# EAGLE design Tiny_UniProg - Arduino Uno (EAGLE 9.5.1)
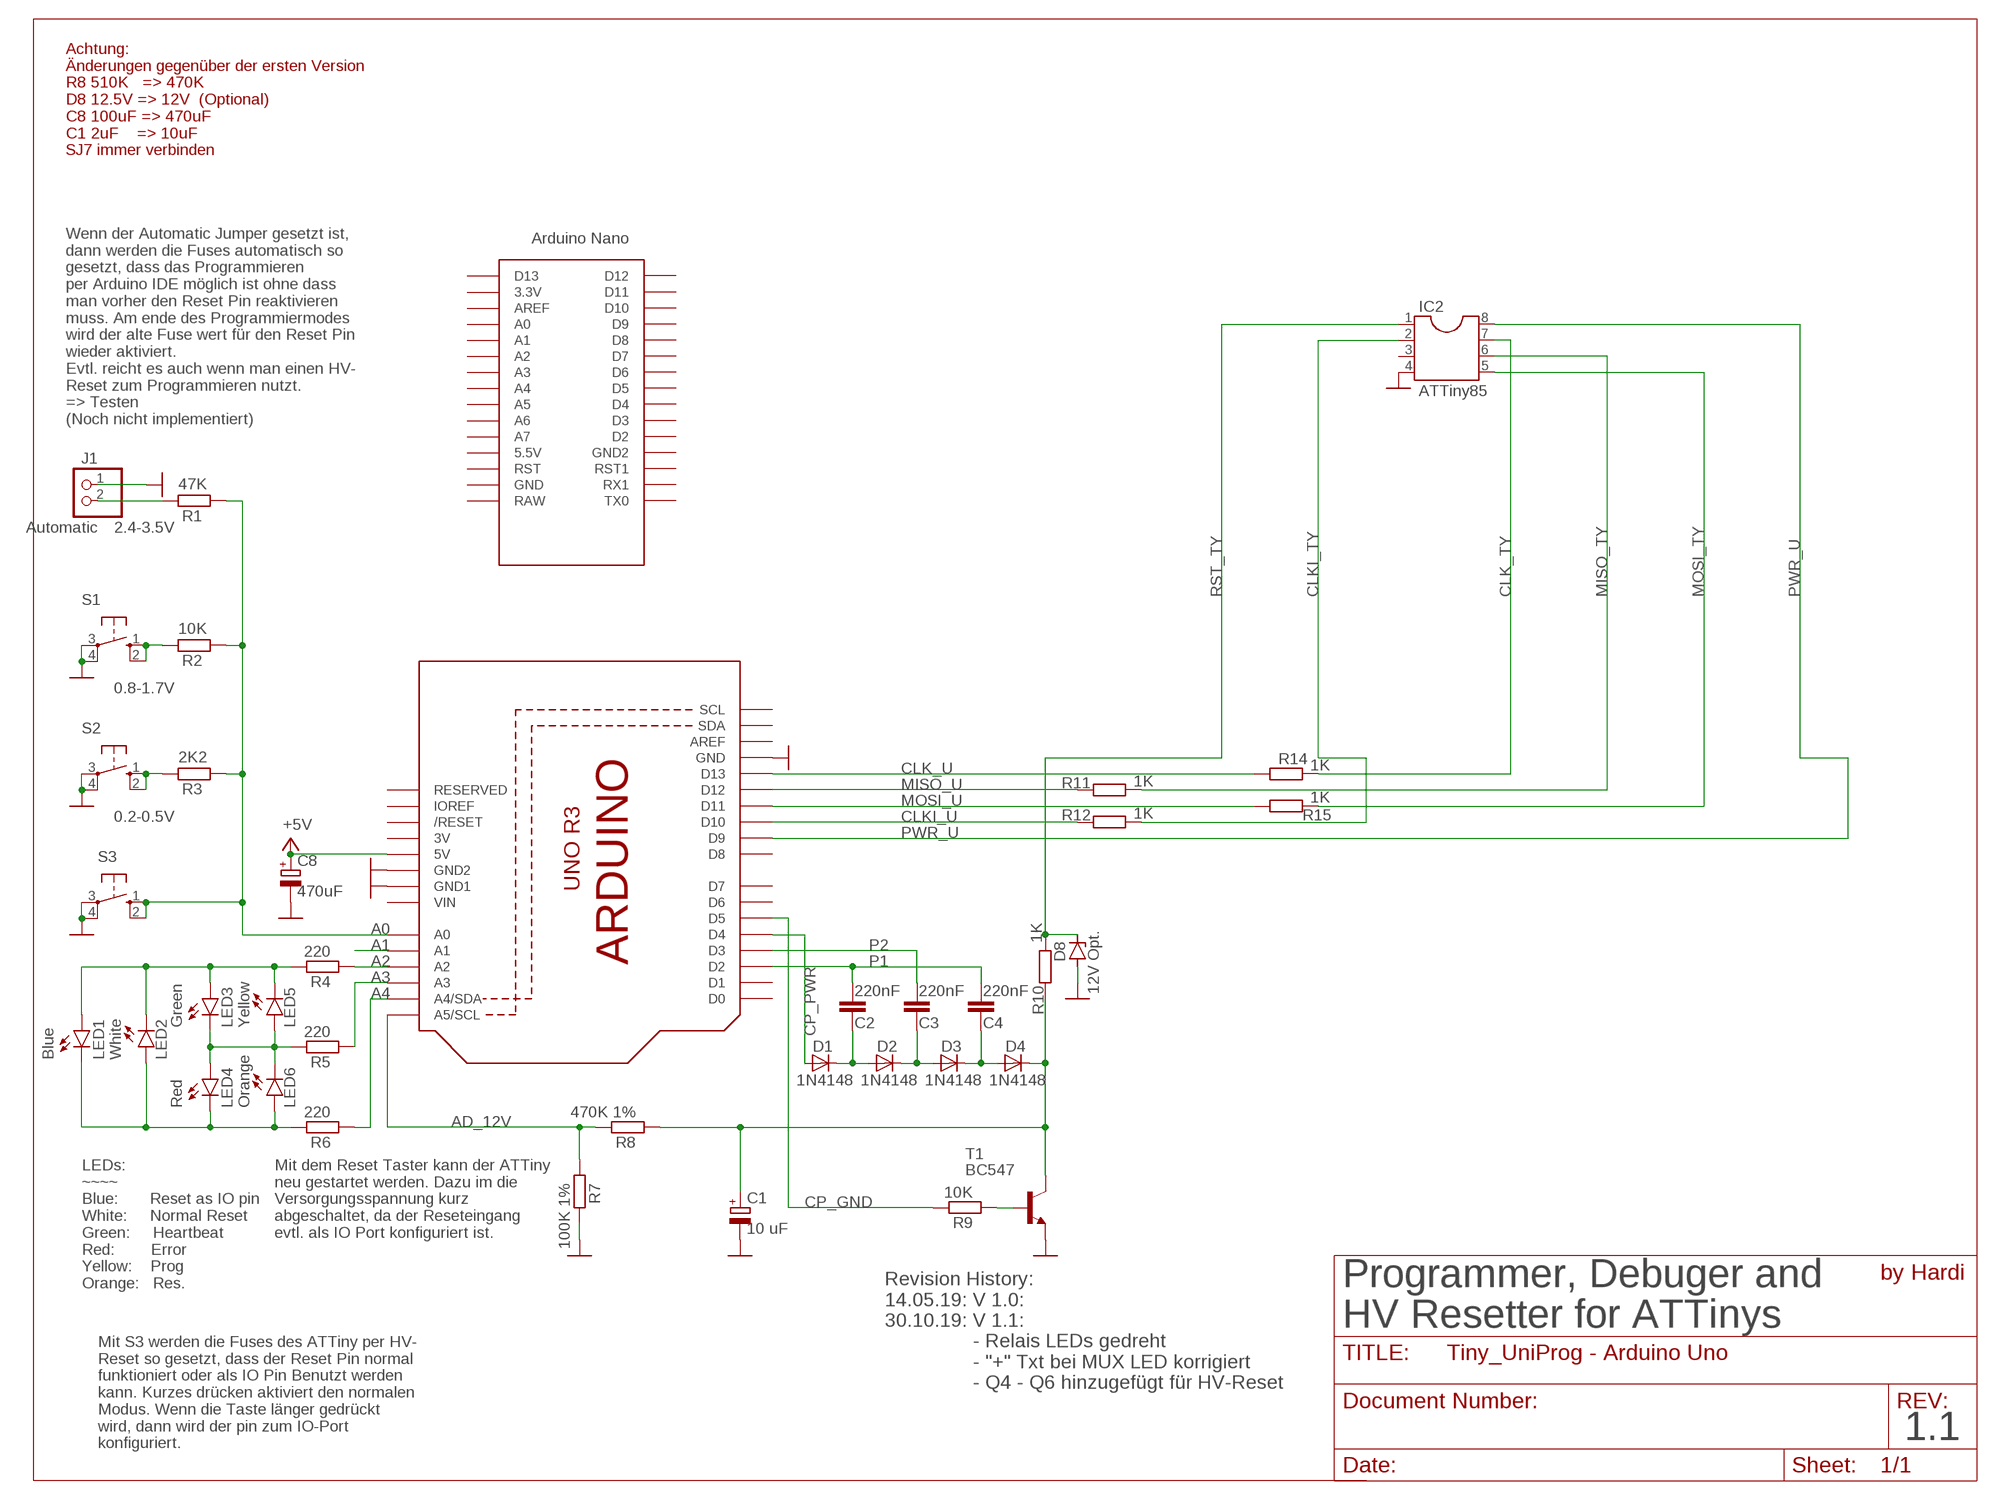
[diagram p0: schematic, sheet 1]

## Parts
C1  10 uF  CPOL-EUE5-5  [E5-5]
C2  220nF  C-EU050-024X044  [C050-024X044]
C3  220nF  C-EU050-024X044  [C050-024X044]
C4  220nF  C-EU050-024X044  [C050-024X044]
C8  470uF  CPOL-EUE5-10.5  [E5-10,5]
D1  1N4148  1N4148DO35-2  [DO35-2]
D2  1N4148  1N4148DO35-2  [DO35-2]
D3  1N4148  1N4148DO35-2  [DO35-2]
D4  1N4148  1N4148DO35-2  [DO35-2]
D8  12V Opt.  ZENER-DIODEZD-2.5  [ZDIO-2.5]
IC2  ATTiny85  DIL8  [DIL08]
J1  Automatic  PINHD-1X2  [1X02]
LED1  Blue  LED3MM  [LED3MM]
LED2  White  LED3MM  [LED3MM]
LED3  Green  LED3MM  [LED3MM]
LED4  Red  LED3MM  [LED3MM]
LED5  Yellow  LED3MM  [LED3MM]
LED6  Orange  LED3MM  [LED3MM]
R1  47K  R-EU_0204/5  [0204/5]
R2  10K  R-EU_0204/2V  [0204V]
R3  2K2  R-EU_0204/2V  [0204V]
R4  220  R-EU_0204/5  [0204/5]
R5  220  R-EU_0204/2V  [0204V]
R6  220  R-EU_0204/5  [0204/5]
R7  100K 1%  R-EU_0204/7  [0204/7]
R8  470K 1%  R-EU_0204/2V  [0204V]
R9  10K  R-EU_0204/7  [0204/7]
R10  1K  R-EU_0207/15  [0207/15]
R11  1K  R-EU_0204/2V  [0204V]
R12  1K  R-EU_0207/7  [0207/7]
R14  1K  R-EU_0204/2V  [0204V]
R15  1K  R-EU_0204/2V  [0204V]
S1  10-XX  [B3F-10XX]
S2  10-XX  [B3F-10XX]
S3  10-XX  [B3F-10XX]
T1  BC547  [TO92]
U1  ARDUINOR3-DIMENSION  [ARDUINOR3]
U$1  NANO  [NANO]

## Nets
+5V: C8.+ U1.5V
A0: R1.1 R2.1 R3.1 S3.1(S) S3.2(S1) U1.A0
A1: U1.A1
A2: R4.1 U1.A2
A3: R5.1 U1.A3
A4: R6.1 U1.A4(A4/SDA)
AD_12V: R7.1 R8.2 U1.A5(A5/SCL)
CLK_TY: IC2.7 R14.2
CLK_U: R14.1 U1.D13
CLKI_TY: IC2.2 R12.2
CLKI_U: R12.1 U1.D10
CP_GND: R9.2 U1.D5
CP_PWR: D1.A U1.D4
GND: C1.- C8.- D8.A IC2.4 J1.1 R7.2 S1.3(P) S1.4(P1) S2.3(P) S2.4(P1) S3.3(P) S3.4(P1) T1.1(E) U1.GND U1.GND1 U1.GND2
MISO_TY: IC2.6 R11.2
MISO_U: R11.1 U1.D12
MOSI_TY: IC2.5 R15.2
MOSI_U: R15.1 U1.D11
N$1: C2.2 D1.C D2.A
N$2: C3.2 D2.C D3.A
N$3: C4.2 D3.C D4.A
N$7: R9.1 T1.2(B)
N$9: C1.+ D4.C R8.1 R10.2 T1.3(C)
N$28: J1.2 R1.2
N$33: R3.2 S2.1(S) S2.2(S1)
N$34: LED1.A LED2.K(C) LED3.A LED5.K(C) R4.2
N$42: LED3.K(C) LED4.A LED5.A LED6.K(C) R5.2
N$44: LED1.K(C) LED2.A LED4.K(C) LED6.A R6.2
N$67: R2.2 S1.1(S) S1.2(S1)
P1: C2.1 C4.1 U1.D2
P2: C3.1 U1.D3
PWR_U: IC2.8 U1.D9
RST_TY: D8.C IC2.1 R10.1
Unconnected: IC2.3 U1.AREF U1.D0 U1.D1 U1.D6 U1.D7 U1.D8 U1.IOREF U1.RESERVED U1.RESET(/RESET) U1.SCL U1.SDA U$1.3.3V U$1.5V(5.5V) U$1.A0 U$1.A1 U$1.A2 U$1.A3 U$1.A4 U$1.A5 U$1.A6 U$1.A7 U$1.AREF U$1.D2 U$1.D3 U$1.D4 U$1.D5 U$1.D6 U$1.D7 U$1.D8 U$1.D9 U$1.D10 U$1.D11 U$1.D12 U$1.D13 U$1.GND U$1.GND1(GND2) U$1.ICSP1 U$1.ICSP2 U$1.ICSP3 U$1.ICSP4 U$1.ICSP5 U$1.ICSP6 U$1.RAW U$1.RST U$1.RST1 U$1.RX1 U$1.TX0

## Notes on the sheet
- Achtung:
  Änderungen gegenüber der ersten Version
  R8 510K   => 470K
  D8 12.5V => 12V  (Optional)
  C8 100uF => 470uF
  C1 2uF    => 10uF
  SJ7 immer verbinden
- Wenn der Automatic Jumper gesetzt ist,
  dann werden die Fuses automatisch so
  gesetzt, dass das Programmieren
  per Arduino IDE möglich ist ohne dass
  man vorher den Reset Pin reaktivieren
  muss. Am ende des Programmiermodes
  wird der alte Fuse wert für den Reset Pin
  wieder aktiviert.
  Evtl. reicht es auch wenn man einen HV-
  Reset zum Programmieren nutzt.
  => Testen
  (Noch nicht implementiert)
- 2.4-3.5V
- 0.8-1.7V
- 0.2-0.5V
- LEDs:
  ~~~~
  Blue:       Reset as IO pin
  White:     Normal Reset
  Green:     Heartbeat
  Red:        Error
  Yellow:    Prog
  Orange:   Res.
- Mit dem Reset Taster kann der ATTiny
  neu gestartet werden. Dazu im die
  Versorgungsspannung kurz
  abgeschaltet, da der Reseteingang
  evtl. als IO Port konfiguriert ist.
- Revision History:
  14.05.19: V 1.0: 
  30.10.19: V 1.1: 
                  - Relais LEDs gedreht 
                  - "+" Txt bei MUX LED korrigiert
                  - Q4 - Q6 hinzugefügt für HV-Reset
- by Hardi
- Programmer, Debuger and 
  HV Resetter for ATTinys
- Mit S3 werden die Fuses des ATTiny per HV-
  Reset so gesetzt, dass der Reset Pin normal
  funktioniert oder als IO Pin Benutzt werden
  kann. Kurzes drücken aktiviert den normalen
  Modus. Wenn die Taste länger gedrückt
  wird, dann wird der pin zum IO-Port 
  konfiguriert.
- 1.1

## Power pins joined to a net without a drawn wire
3V: U1.3V
VIN: U1.VIN

## Library data of the parts
C1 C8 = rcl:CPOL-EU: POLARIZED CAPACITOR, European symbol; SPICEPREFIX: C
C2-C4 = rcl:C-EU: CAPACITOR, European symbol; SPICEPREFIX: C
D1-D4 = diode:1N4148: DIODE high speed (Philips)
D8 = diode:ZENER-DIODE: Z-Diode
IC2 = ic-package:DIL8: Dual In Line / Socket
J1 = pinhead:PINHD-1X2: PIN HEADER
LED1-LED6 = led:LED: LED OSRAM: - CHIPLED LG R971, LG N971, LY N971, LG Q971, LY Q971, LO R971, LY R971 LH N974, LH R974 LS Q976, LO Q976, LY Q976 LO Q996 - Hyper CHIPLED LW Q18S LB Q993, LB Q99A, LB R99A - SideLED LS A670, LO A670, LY A670, LG A670, LP A670 LB A673, LV A673, LT A673, LW A673 LH A674 LY A675 LS A676, LA A676, LO A676, LY A676, LW A676 LS A679, LY A679, LG A679 - Hyper Micro SIDELED® LS Y876, LA Y876, LO Y876, LY Y876 LT Y87S - SmartLED LW L88C, LW L88S LB L89C, LB L89S, LG L890 LS L89K, LO L89K, LY L89K LS L896, LA L896, LO L896, LY L896 - TOPLED LS T670, LO T670, LY T670, LG T670, LP T670 LSG T670, LSP T670, LSY T670, LOP T670, LYG T670 LG T671, LOG T671, LSG T671 LB T673, LV T673, LT T673, LW T673 LH T674 LS T676, LA T676, LO T676, LY T676, LB T676, LH T676, LSB T676, LW T676 LB T67C, LV T67C, LT T67C, LS T67K, LO T67K, LY T67K, LW E67C LS E67B, LA E67B, LO E67B, LY E67B, LB E67C, LV E67C, LT E67C LW T67C LS T679, LY T679, LG T679 LS T770, LO T770, LY T770, LG T770, LP T770 LB T773, LV T773, LT T773, LW T773 LH T774 LS E675, LA E675, LY E675, LS T675 LS T776, LA T776, LO T776, LY T776, LB T776 LHGB T686 LT T68C, LB T68C - Hyper Mini TOPLED® LB M676 - Mini TOPLED Santana® LG M470 LS M47K, LO M47K, LY M47K Source: http://www.osram.convergy.de LUXEON: - LUMILED® LXK2-PW12-R00, LXK2-PW12-S00, LXK2-PW14-U00, LXK2-PW14-V00 LXK2-PM12-R00, LXK2-PM12-S00, LXK2-PM14-U00 LXK2-PE12-Q00, LXK2-PE12-R00, LXK2-PE12-S00, LXK2-PE14-T00, LXK2-PE14-U00 LXK2-PB12-K00, LXK2-PB12-L00, LXK2-PB12-M00, LXK2-PB14-N00, LXK2-PB14-P00, LXK2-PB14-Q00 LXK2-PR12-L00, LXK2-PR12-M00, LXK2-PR14-Q00, LXK2-PR14-R00 LXK2-PD12-Q00, LXK2-PD12-R00, LXK2-PD12-S00 LXK2-PH12-R00, LXK2-PH12-S00 LXK2-PL12-P00, LXK2-PL12-Q00, LXK2-PL12-R00 Source: www.luxeon.com KINGBRIGHT: KA-3528ASYC Source: www.kingbright.com
R1-R12 R14 R15 = rcl:R-EU_: RESISTOR, European symbol; SPICEPREFIX: R
S1-S3 = switch-omron:10-XX: OMRON SWITCH; MPN: B3F-1000; OC_FARNELL: 176432; OC_NEWARK: 36M3542
T1 = transistor:BC547: NPN TRANSISTOR
U1 = adafruit:ARDUINOR3: This is a new object for the new Arduino R3 - with extra pins that you may want to use (such as IOref, and duplicated A4/A5
U$1 = Arduino-clone:NANO: Arduino Nano

## Board
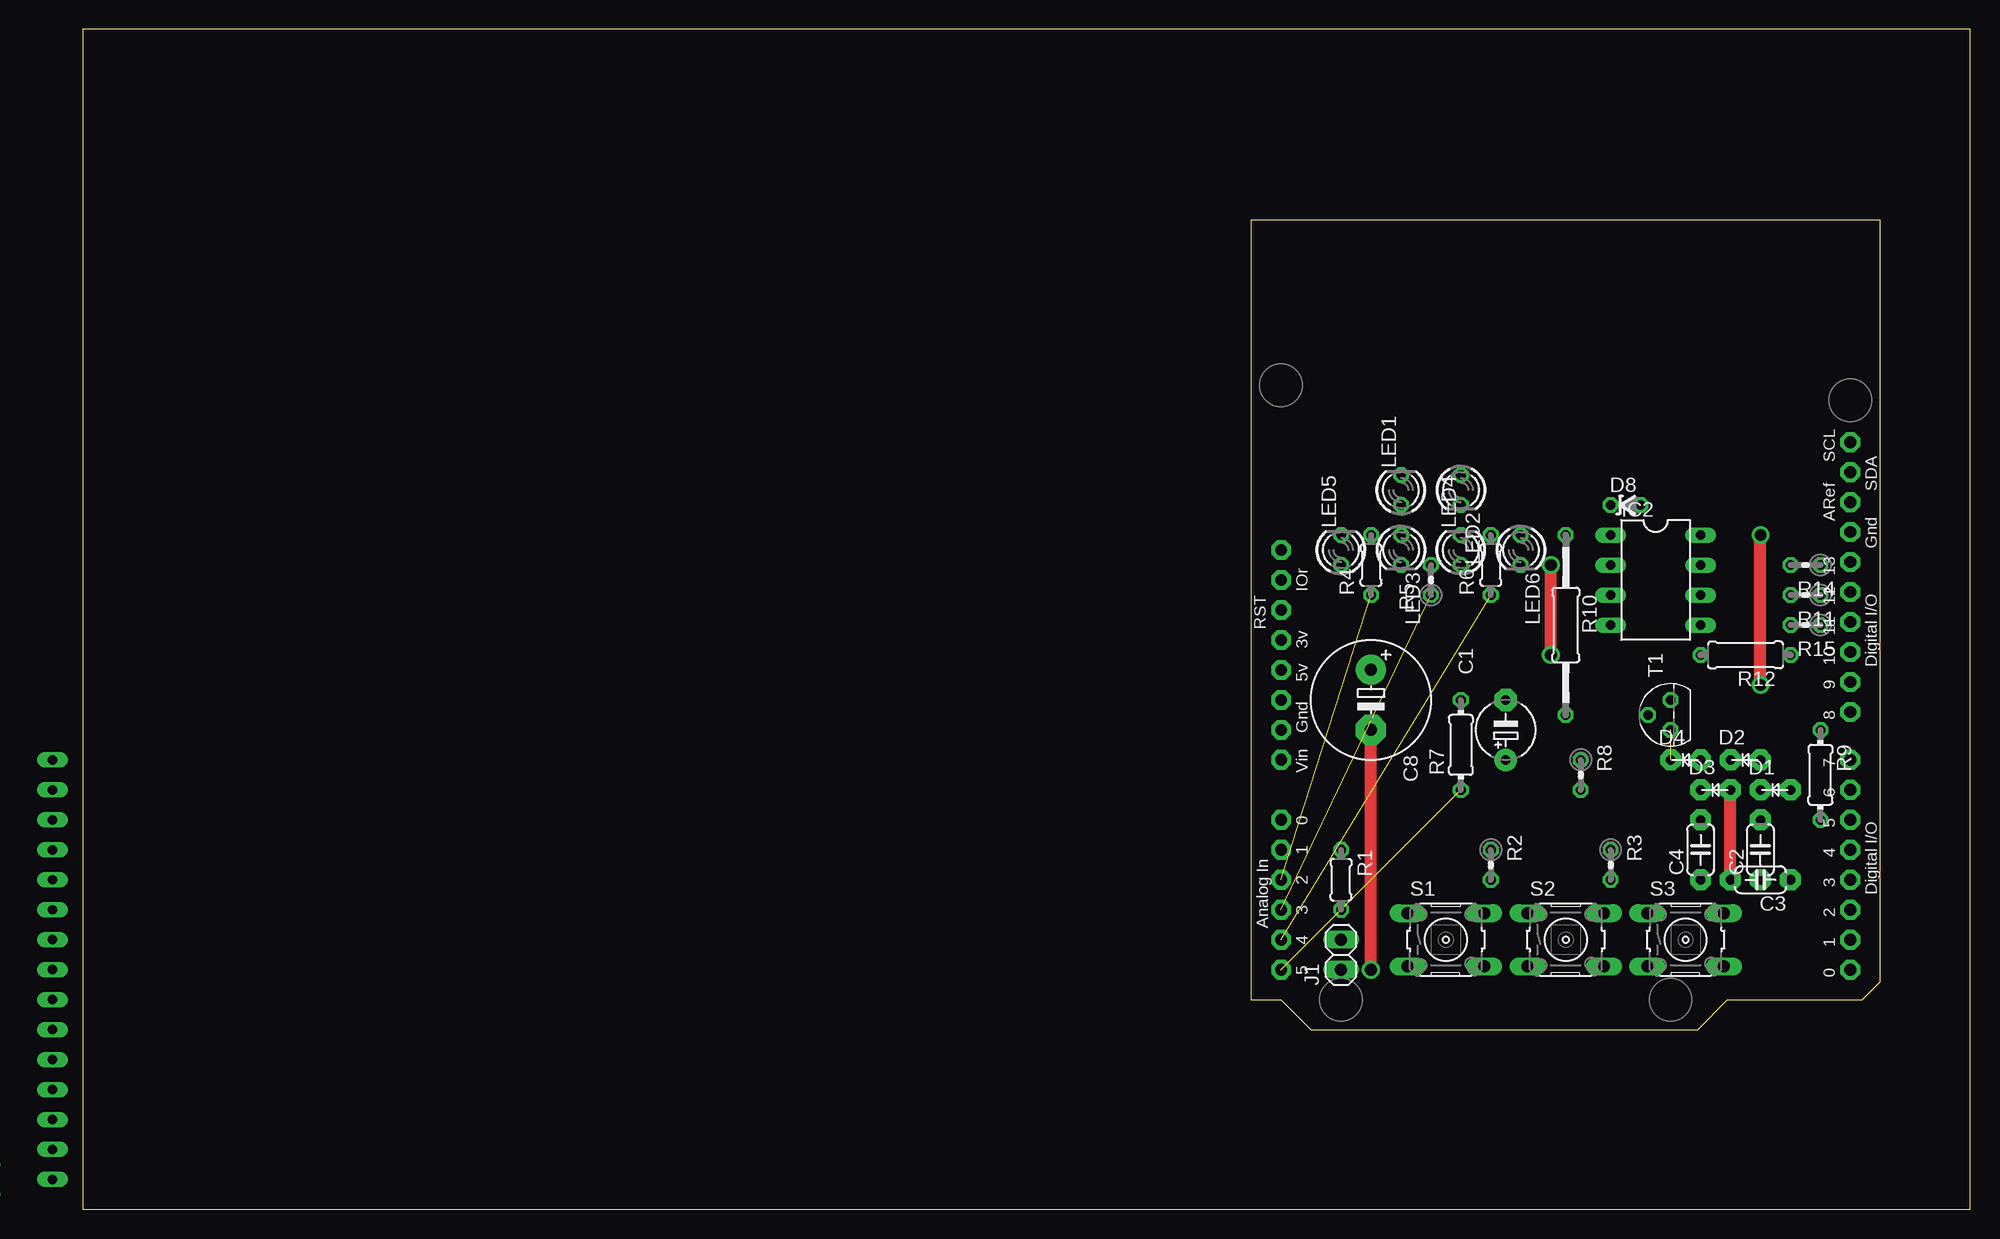
[diagram p1: board, top side]
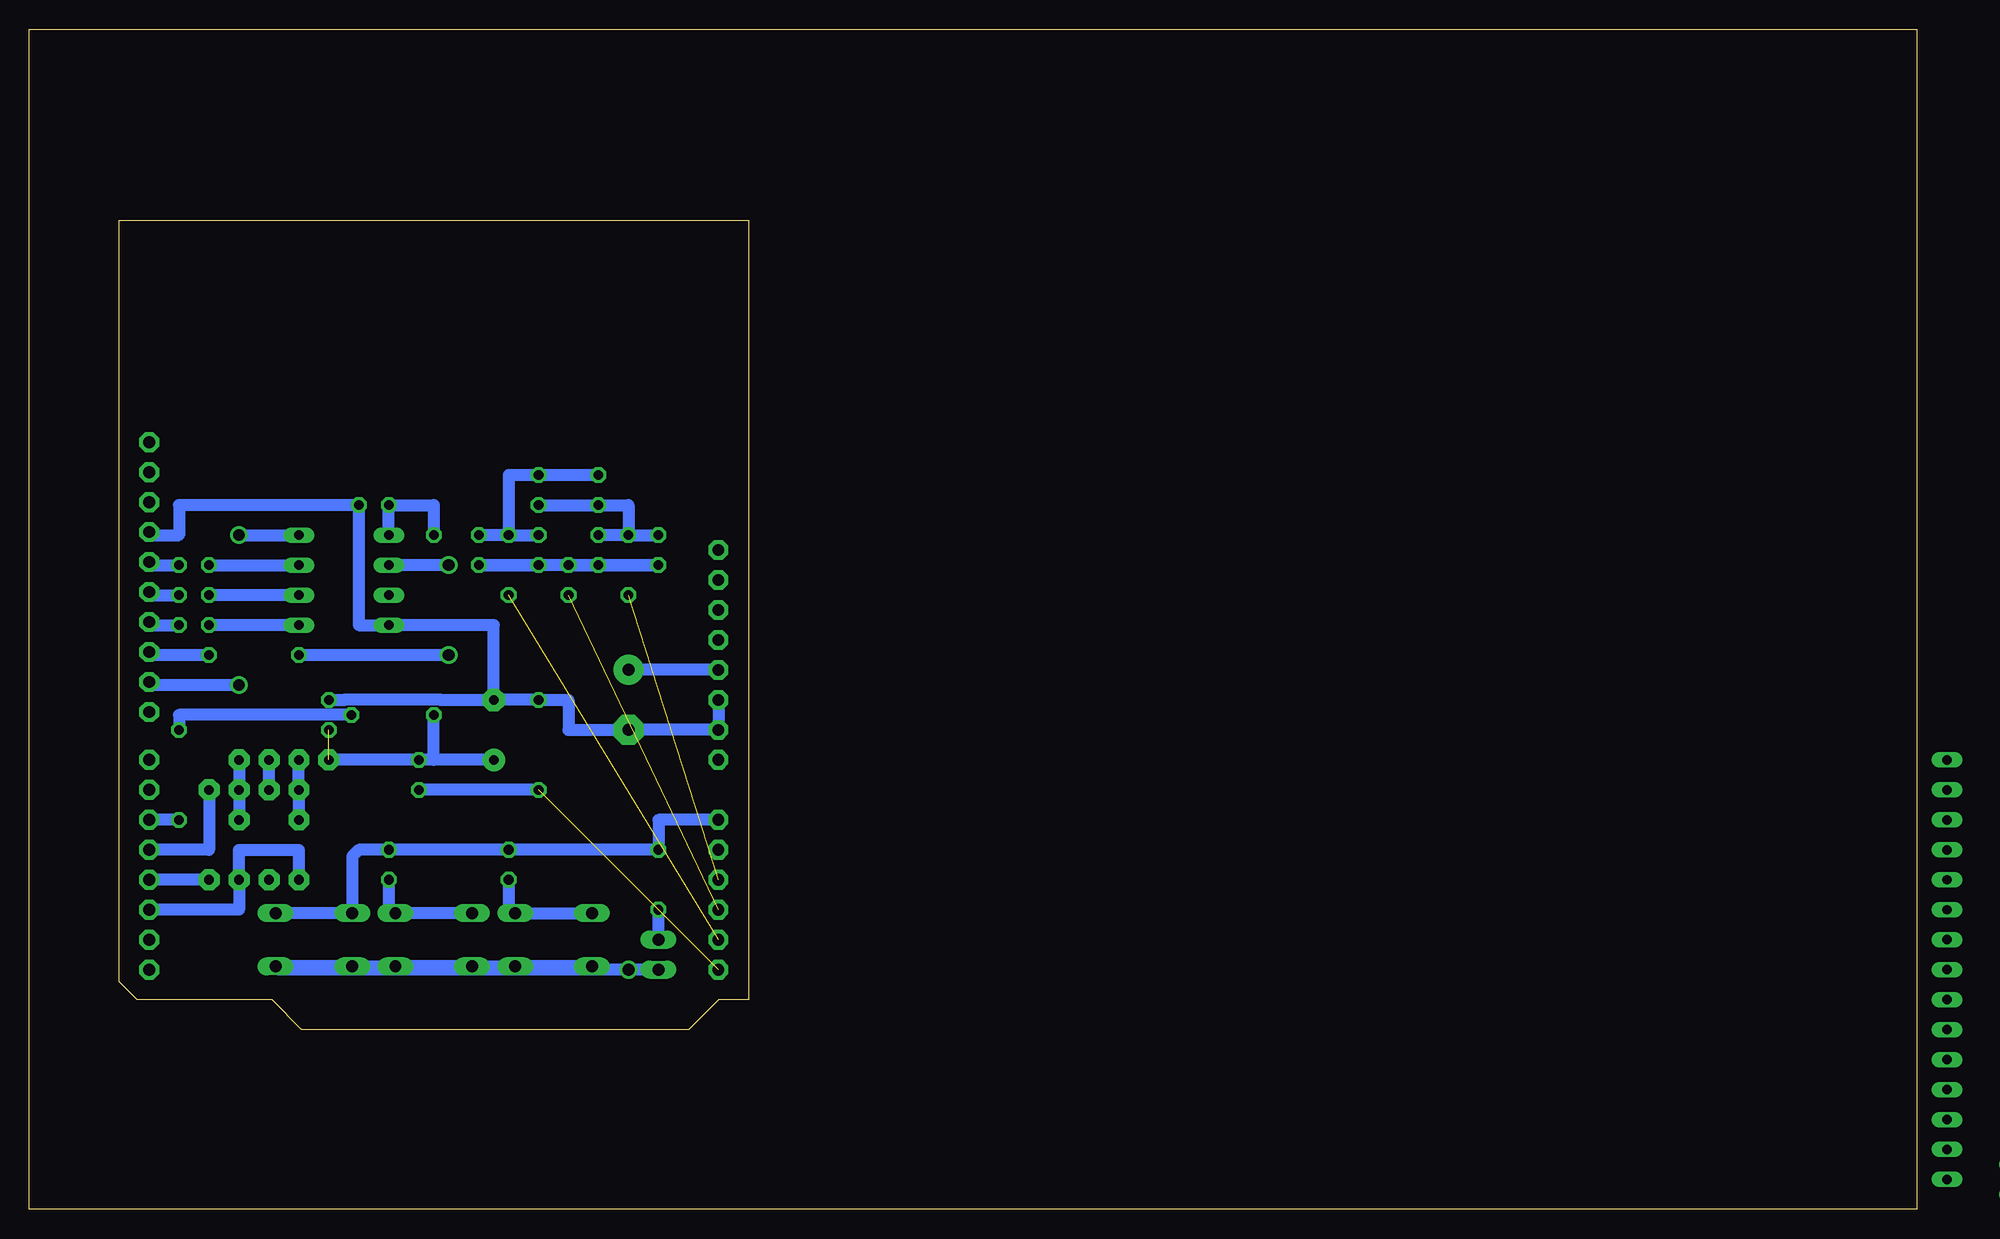
[diagram p2: board, bottom side, seen from below]

Size 160 x 100 mm. Coordinates in mm from the lower left corner, seen from the top.
Outline: 0,0 160,0 160,100 0,100 0,0
Copper layers (1*16): Top 0.035mm / dielectric 1.5mm / Bottom 0.035mm
Design rules "default": minimum track width 6mil, minimum drill 0.35mm, track to track 6mil, track to pad 6mil, pad to pad 6mil, via to via 6mil, smd to smd 6mil, copper to edge 40mil, drill to drill 6mil, minimum pad ring 10mil, minimum via ring 8mil, stop-mask expansion 4mil, vias tented up to drill 0mil, thermal gap 10mil

### Footprints (pad centres in the part's own frame; a part is rotated, then mirrored left to right if it is on the bottom)
E5-5 = drill 0.813 pad 1.905: + -2.54,0 | drill 0.813 pad 1.905 octagon: - 2.54,0
C050-024X044 = drill 0.813 pad 1.778 octagon: 1 -2.54,0; 2 2.54,0
E5-10,5 = drill 1.016 pad 2.54: + -2.54,0 | drill 1.016 pad 2.54 octagon: - 2.54,0
DO35-2 = drill 0.813 pad 1.778 octagon: A 1.27,0; C -1.27,0
ZDIO-2.5 = drill 0.813 octagon: A 1.27,0; C -1.27,0
DIL08 = drill 0.813 long: 1 -3.81,-3.81; 2 -1.27,-3.81; 3 1.27,-3.81; 4 3.81,-3.81; 5 3.81,3.81; 6 1.27,3.81; 7 -1.27,3.81; 8 -3.81,3.81
1X02 = drill 1.016 long: 1 -1.27,0; 2 1.27,0
LED3MM = drill 0.813 octagon: A -1.27,0; K 1.27,0
0204/5 = drill 0.813 octagon: 1 -2.54,0; 2 2.54,0
0204V = drill 0.813 octagon: 1 -1.27,0; 2 1.27,0
0204/7 = drill 0.813 octagon: 1 -3.81,0; 2 3.81,0
0207/15 = drill 0.813 octagon: 1 -7.62,0; 2 7.62,0
0207/7 = drill 0.813 octagon: 1 -3.81,0; 2 3.81,0
B3F-10XX = drill 1.016 long: 1 -3.251,2.261; 2 3.251,2.261; 3 -3.251,-2.261; 4 3.251,-2.261
TO92 = drill 0.813 octagon: 1 1.27,0; 2 0,1.905; 3 -1.27,0
ARDUINOR3 = drill 1 pad 1.676 octagon: 3V 35.56,2.54; 5V 38.1,2.54; A0 50.8,2.54; A1 53.34,2.54; A2 55.88,2.54; A3 58.42,2.54; A4 60.96,2.54; A5 63.5,2.54; AREF 23.876,50.8; D0 63.5,50.8; D1 60.96,50.8; D2 58.42,50.8; D3 55.88,50.8; D4 53.34,50.8; D5 50.8,50.8; D6 48.26,50.8; D7 45.72,50.8; D8 41.656,50.8; D9 39.116,50.8; D10 36.576,50.8; D11 34.036,50.8; D12 31.496,50.8; D13 28.956,50.8; GND 26.416,50.8; GND1 43.18,2.54; GND2 40.64,2.54; IOREF 30.48,2.54; RESERVED 27.94,2.54; RESET 33.02,2.54; SCL 18.796,50.8; SDA 21.336,50.8; VIN 45.72,2.54
NANO = drill 0.8 long: 3.3V -10.16,24.13; 5V -10.16,-1.27; A0 -10.16,19.05; A1 -10.16,16.51; A2 -10.16,13.97; A3 -10.16,11.43; A4 -10.16,8.89; A5 -10.16,6.35; A6 -10.16,3.81; A7 -10.16,1.27; AREF -10.16,21.59; D2 5.08,1.27; D3 5.08,3.81; D4 5.08,6.35; D5 5.08,8.89; D6 5.08,11.43; D7 5.08,13.97; D8 5.08,16.51; D9 5.08,19.05; D10 5.08,21.59; D11 5.08,24.13; D12 5.08,26.67; D13 -10.16,26.67; GND -10.16,-6.35; GND1 5.08,-1.27; RAW -10.16,-8.89; RST -10.16,-3.81; RST1 5.08,-3.81; RX1 5.08,-6.35; TX0 5.08,-8.89 | drill 0.8: ICSP1 -5.08,-10.16; ICSP2 -5.08,-7.62; ICSP3 -2.54,-10.16; ICSP4 -2.54,-7.62; ICSP5 0,-10.16; ICSP6 0,-7.62

### Placement (x,y rotation side)
C1  120.65,40.64 90 top
C2  142.24,30.48 90 top
C3  142.24,27.94 180 top
C4  137.16,30.48 90 top
C8  109.22,43.18 270 top
D1  143.51,35.56 0 top
D2  140.97,38.1 0 top
D3  138.43,35.56 0 top
D4  135.89,38.1 0 top
D8  130.81,59.69 0 top
IC2  133.35,53.34 270 top
J1  106.68,21.59 90 top
LED1  111.76,60.96 90 top
LED2  116.84,60.96 270 top
LED3  111.76,55.88 270 top
LED4  116.84,55.88 90 top
LED5  106.68,55.88 90 top
LED6  121.92,55.88 270 top
R1  106.68,27.94 270 top
R2  119.38,29.21 270 top
R3  129.54,29.21 270 top
R4  109.22,54.61 90 top
R5  114.3,53.34 90 top
R6  119.38,54.61 90 top
R7  116.84,39.37 90 top
R8  127,36.83 270 top
R9  147.32,36.83 270 top
R10  125.73,49.53 270 top
R11  146.05,52.07 180 top
R12  140.97,46.99 180 top
R14  146.05,54.61 180 top
R15  146.05,49.53 180 top
S1  115.57,22.86 0 top
S2  125.73,22.86 0 top
S3  135.89,22.86 0 top
T1  134.62,41.91 90 top
U1  99.06,83.82 270 top
U$1  -7.62,11.43 0 top

### Tracks (layer width: path | path; a pad name or v marks a point on that pad's centre or on a via)
+5V
  Bottom 1.016: U1.5V C8.+
A0
  Bottom 1.016: S3.2 S3.1 132.64,29.92 132.08,30.48 R3.1 R2.1 R1.1 106.68,33.02 U1.A0
A2  (1 unrouted)
A3  (1 unrouted)
A4  (1 unrouted)
AD_12V  (1 unrouted)
  Bottom 1.016: R7.1 R8.2
CLK_TY
  Bottom 1.016: R14.2 IC2.7
CLK_U
  Bottom 1.016: U1.D13 149.61,54.61 R14.1
CLKI_TY  (via drill 1)
  Top 1.016: v124.46,46.99 v124.46,54.61
  Bottom 1.016: R12.2 v124.46,46.99 | v124.46,54.61 IC2.2
CLKI_U
  Bottom 1.016: U1.D10 149.61,46.99 R12.1
CP_GND
  Bottom 1.016: R9.2 U1.D5
CP_PWR
  Bottom 1.016: D1.A 144.78,30.48 U1.D4
GND  (via drill 1)
  Top 1.016: v109.22,20.32 C8.-
  Bottom 1.016: S3.3 S3.4 | S3.4 S2.3 S2.4 S1.3 S1.4 | S3.4 138.86,20.32 v109.22,20.32 J1.1 | U1.GND 149.61,57.15 147.32,57.15 147.32,59.69 D8.A 132.08,49.53 IC2.4 120.65,49.53 C1.- | U1.GND2 U1.GND1 C8.- 114.3,40.64 114.3,43.18 R7.2 C1.- | T1.1 133.31,43.18 133.26,43.23 125.18,43.23 125.13,43.18 C1.-
  other vias: 109.22,40.64
MISO_TY
  Bottom 1.016: IC2.6 R11.2
MISO_U
  Bottom 1.016: U1.D12 149.61,52.07 R11.1
MOSI_TY
  Bottom 1.016: IC2.5 R15.2
MOSI_U
  Bottom 1.016: U1.D11 149.61,49.53 R15.1
N$1
  Bottom 1.016: D2.A D1.C C2.2
N$2
  Top 1.016: C3.2 D3.A
  Bottom 1.016: D3.A D2.C
N$3
  Bottom 1.016: C4.2 D3.C D4.A
N$7
  Bottom 1.016: T1.2 147.32,41.91 R9.1
N$9  (1 unrouted)
  Bottom 1.016: 125.73,38.1 R8.1 D4.C | C1.+ 125.73,38.1 | 125.73,38.1 R10.2
N$28
  Bottom 1.016: J1.2 R1.2
N$33
  Bottom 1.016: S2.1 S2.2 129.54,25.68 R3.2
N$34
  Bottom 1.016: R4.2 LED5.K | LED2.K LED1.A 109.22,59.69 R4.2 | R4.2 LED3.A
N$42
  Bottom 1.016: LED4.A LED6.K LED5.A | LED3.K LED5.A | R5.2 LED5.A
N$44
  Bottom 1.016: R6.2 LED4.K | LED1.K LED2.A 119.38,62.23 R6.2 | R6.2 LED6.A
N$67
  Bottom 1.016: S1.1 S1.2 119.38,25.68 R2.2
P1
  Bottom 1.016: C4.1 137.16,30.48 142.24,30.48 C2.1 142.24,25.4 U1.D2
P2
  Bottom 1.016: C3.1 U1.D3
PWR_U  (via drill 1)
  Top 1.016: v142.24,44.45 v142.24,57.15
  Bottom 1.016: U1.D9 149.61,44.45 v142.24,44.45 | v142.24,57.15 IC2.8
RST_TY
  Bottom 1.016: IC2.1 D8.C 125.73,59.69 R10.1